# Altium project audioAmp.PrjPcb
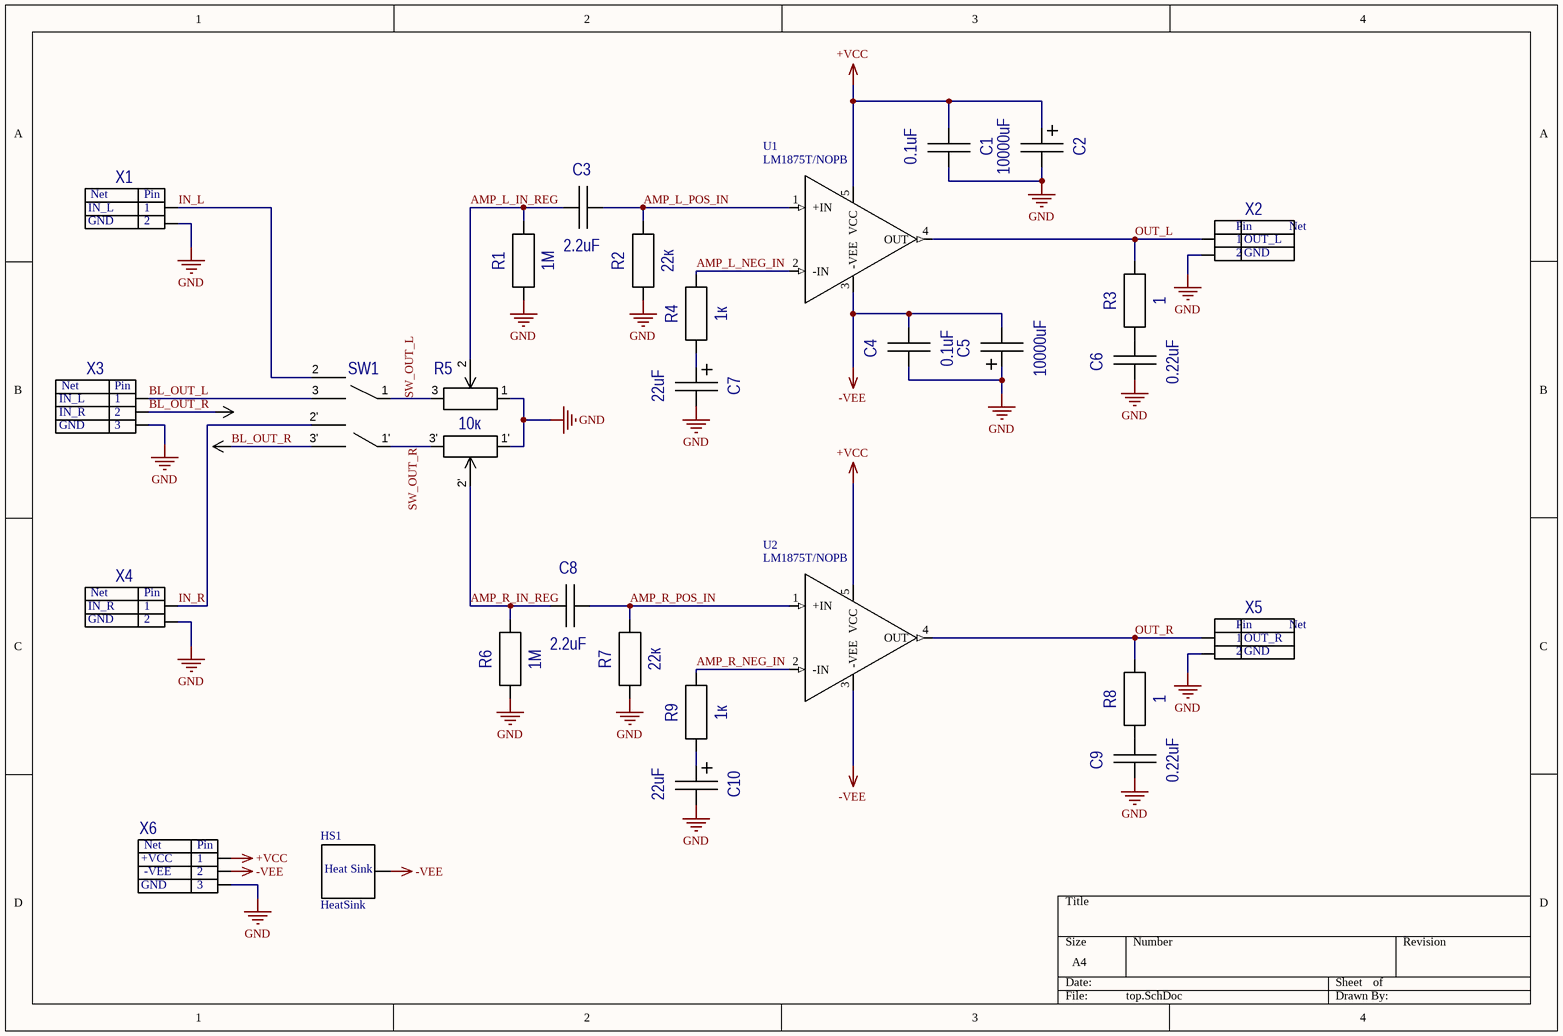
[diagram p0: top.SchDoc]
1 sheet, 29 parts. Net scope: global (net labels, ports and power ports of the same name join across sheets).
Board file: PCB1.PcbDoc

## Sheet top.SchDoc
size A4

### Parts
C1  0.1uF  [capK73-17]
C2  10000uF  [Capacitor_SnapIn_35x50mm]
C3  2.2uF  [capK73-17]
C4  0.1uF  [capK73-17]
C5  10000uF  [Capacitor_SnapIn_35x50mm]
C6  0.22uF  [capK73-17]
C7  22uF  [capRadial6.3x12mmP:2.5mm]
C8  2.2uF  [capK73-17]
C9  0.22uF  [capK73-17]
C10  22uF  [capRadial6.3x12mmP:2.5mm]
HS1  HeatSink  [HeatSink]
R1  1М  [res0.25W/1M/0.5pitch]
R2  22к  [res0.25W/22k/400mil]
R3  1  [res1W/1/700mil]
R4  1к  [res0.25W/1k/400mil]
R5  10к  [dualVarRes]
R6  1М  [res0.25W/1M/0.5pitch]
R7  22к  [res0.25W/22k/400mil]
R8  1  [res1W/1/700mil]
R9  1к  [res0.25W/1k/400mil]
SW1  (no value)  [dualVarRes]
U1  LM1875T/NOPB  [TO220-5/2.54]
U2  LM1875T/NOPB  [TO220-5/2.54]
X1  Parameter 2: IN_L  Parameter 1: GND  [BUTTON_template]
X2  Parameter 2: OUT_L  Parameter 1: GND  [BUTTON_template]
X3  (no value)  [3pim2.54Connector]
X4  Parameter 2: IN_R  Parameter 1: GND  [BUTTON_template]
X5  Parameter 2: OUT_R  Parameter 1: GND  [BUTTON_template]
X6  Parameter 3: +VCC  Parameter 2: -VEE  Parameter 1: GND  [3pim2.54Connector]

### Nets
+VCC: C1.1 C2.1(+) U1.5(VCC) U2.5(VCC) X6.1
-VEE: C4.2 C5.2(-) HS1.1(HS) U1.3(-VEE) U2.3(-VEE) X6.2
GND: C1.2 C2.2(-) C4.1 C5.1(+) C6.1 C7.2(-) C9.1 C10.2(-) R1.1 R2.1 R5.1 R5.1' R6.1 R7.1 X1.2 X2.2 X3.3 X4.2 X5.2 X6.3
AMP_L_IN_REG: C3.1 R1.2 R5.2
AMP_L_NEG_IN: R4.2 U1.2(-IN)
AMP_L_POS_IN: C3.2 R2.2 U1.1(+IN)
AMP_R_IN_REG: C8.1 R5.2' R6.2
AMP_R_NEG_IN: R9.2 U2.2(-IN)
AMP_R_POS_IN: C8.2 R7.2 U2.1(+IN)
BL_OUT_L: SW1.3 X3.1
BL_OUT_R: SW1.3' X3.2
IN_L: SW1.2 X1.1
IN_R: SW1.2' X4.1
OUT_L: R3.2 U1.4(OUT) X2.1
OUT_R: R8.2 U2.4(OUT) X5.1
SW_OUT_L: R5.3 SW1.1
SW_OUT_R: R5.3' SW1.1'
NetC6_2: C6.2 R3.1
NetC7_1: C7.1(+) R4.1
NetC9_2: C9.2 R8.1
NetC10_1: C10.1(+) R9.1

### Notes on the sheet
- (in symbol 2pinConnector) Net; Pin
- (in symbol 3pinConnector) Net; Pin
- (in symbol BluetoothModule) Net; Pin; IN_L; IN_R; GND
- (in symbol HeatSink) Heat Sink

### Library data of the parts
C1 C4 = К73-17, 0.1 мкФ, 250 В, 5%: 26320; Model: *; Other: *; Value: 0.1uF
C2 C5 = ECAP (К50-35), 10000 мкФ, 50 В, 105°C, 20%: 26320; Model: *; Other: *; Value: 10000uF
C3 C8 = К73-17, 2.2 мкФ, 63 В, 5%: 8016; Model: *; Other: *; Value: 2.2uF
C6 C9 = К73-17, 0.22 мкФ, 63 В, 5%: 61862; Model: *; Other: *; Value: 0.22uF
C7 C10 = ECAP (К50-35), 10000 мкФ, 50 В, 105°C, 20%_1: 9000565851; Model: *; Other: *; Value: 22uF
R1 R6 = CF-25 (С1-4) 0.25 Вт, 1 МОм, 5%: 51741; Other: *; Value: 1М
R2 R7 = 1/4W22K, Резистор угольный 1/4Вт 22 кОм 2,5X7мм 5%: 8007031688; Other: *; Value: 22к
R3 R8 = MO-100 (С2-23) 1 Вт, 1 Ом, 5%: 24035; Other: *; Value: 1
R4 R9 = CF-25 (С1-4) 0.25 Вт, 1 кОм, 5%: 44435; Other: *; Value: 1к
R5 = RK-1233G1-A10K, L15KC, 2 х 10 кОм: 588623436; Other: *; Value: 10к
SW1 = SWITCHER: -; Other: *
U1 U2 = LM1875T/NOPB: 12717
X1 X2 X4 X5 = 2pinConnector: Generic connector; Other: *
X3 = BluetoothModule: Input from Bluetooth module; Other: *
X6 = 3pinConnector: Generic connector; Other: *